# EAGLE design CanBus-Y (EAGLE 7.4.0)
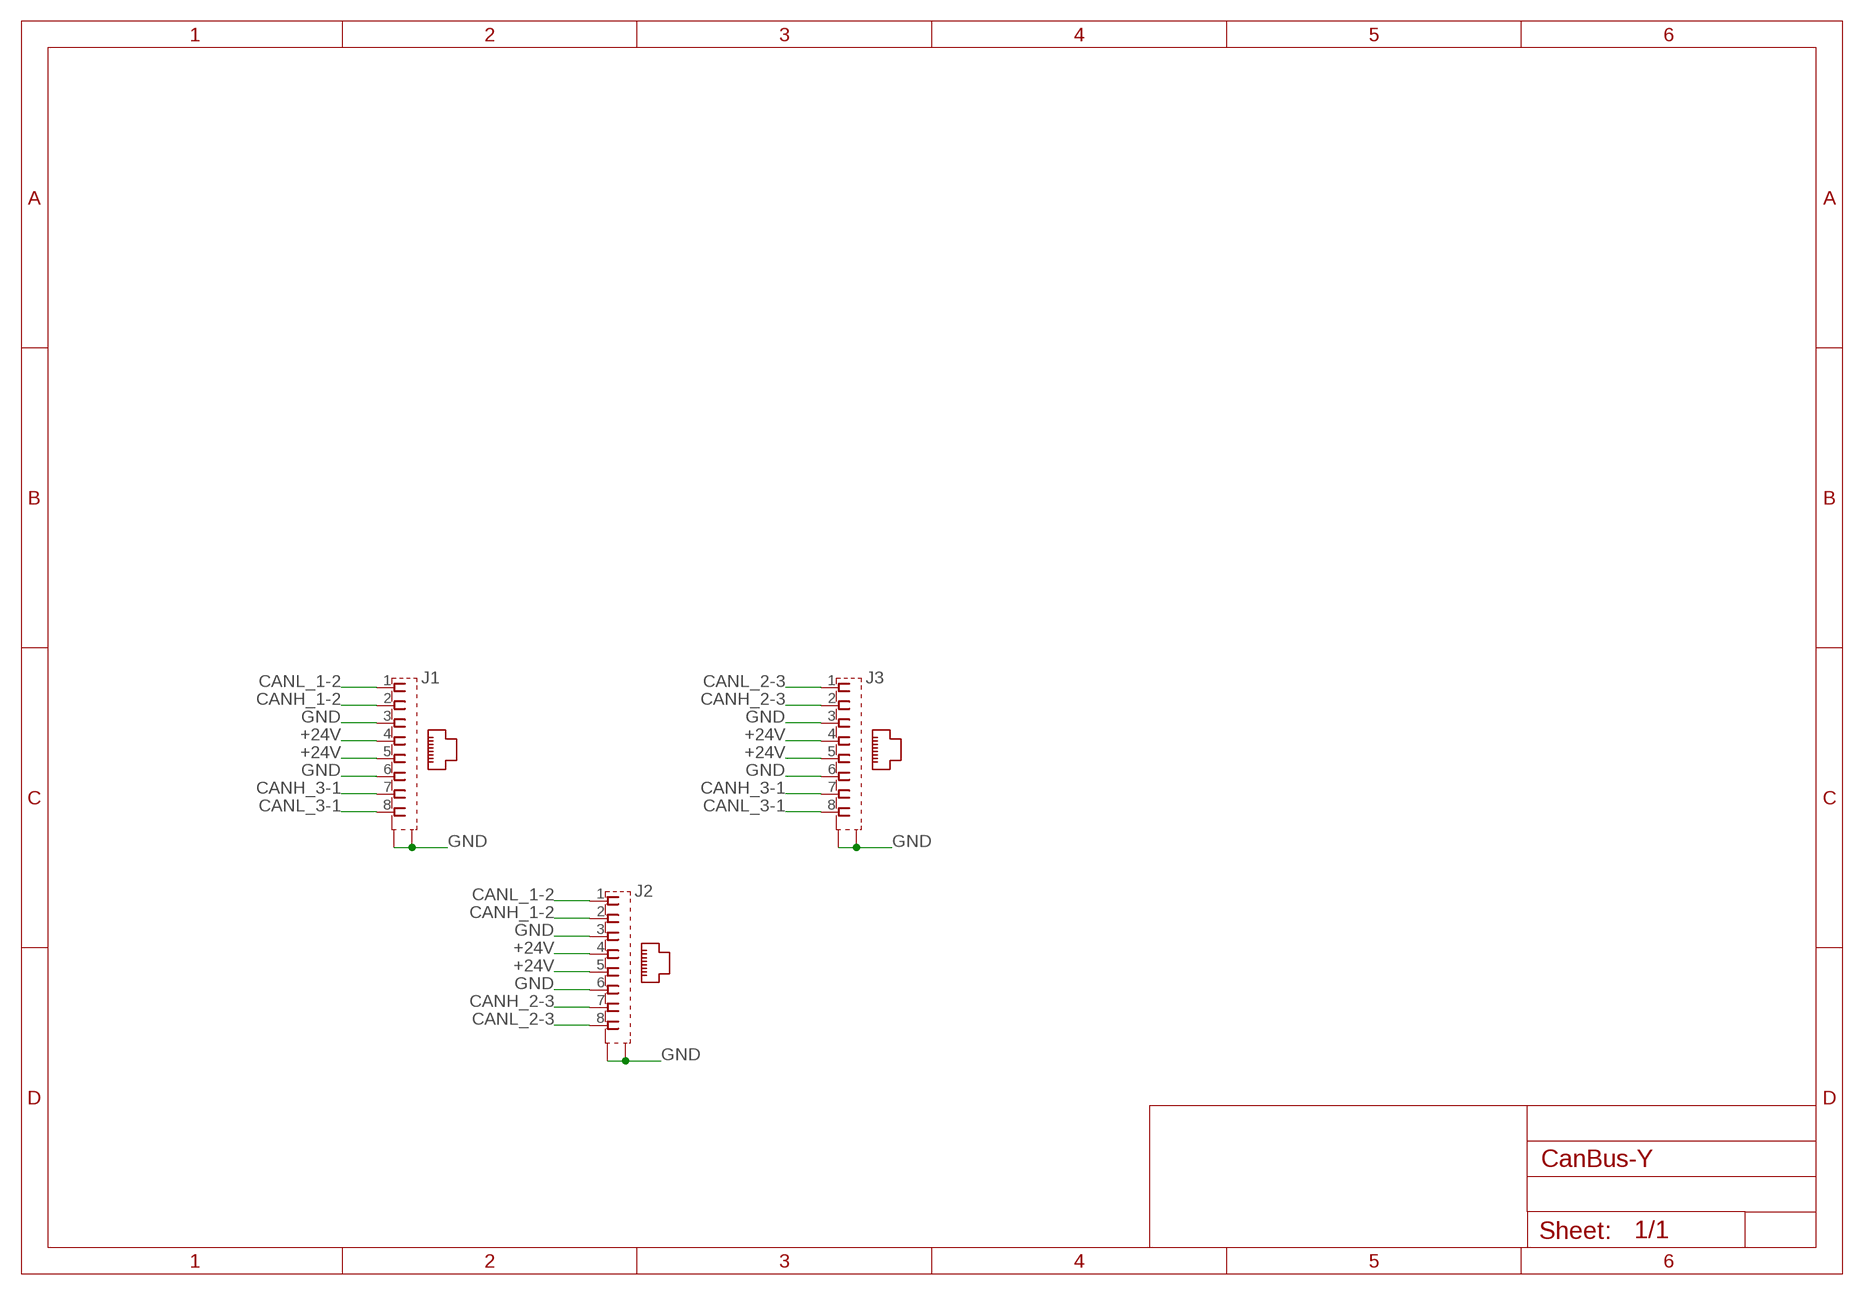
[diagram p0: schematic, sheet 1]

## Parts
J1  555141-1  [MEBP_8-8G]
J2  555141-1  [MEBP_8-8G]
J3  555141-1  [MEBP_8-8G]

## Nets
+24V: J1.4 J1.5 J2.4 J2.5 J3.4 J3.5
CANH_1-2: J1.2 J2.2
CANH_2-3: J2.7 J3.2
CANH_3-1: J1.7 J3.7
CANL_1-2: J1.1 J2.1
CANL_2-3: J2.8 J3.1
CANL_3-1: J1.8 J3.8
GND: J1.3 J1.6 J1.G1(S1) J1.G2(S2) J2.3 J2.6 J2.G1(S1) J2.G2(S2) J3.3 J3.6 J3.G1(S1) J3.G2(S2)

## Library data of the parts
J1-J3 = mebp_8-8g:555141-1: AMP connector Reichelt Bestell-Nr. MEBP 8-8G

## Board
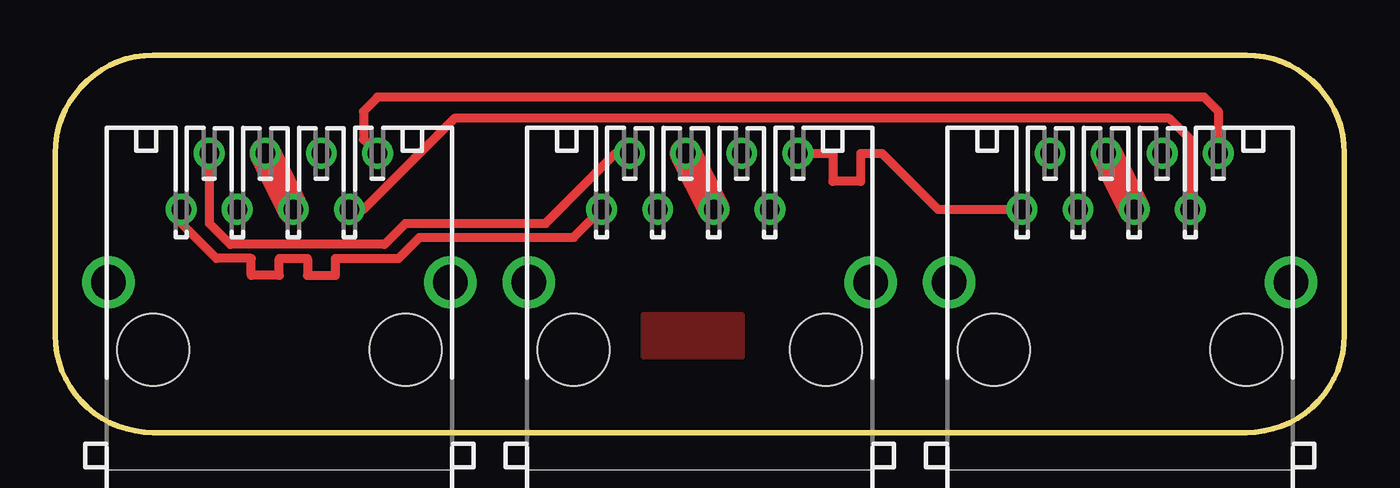
[diagram p1: board, top side]
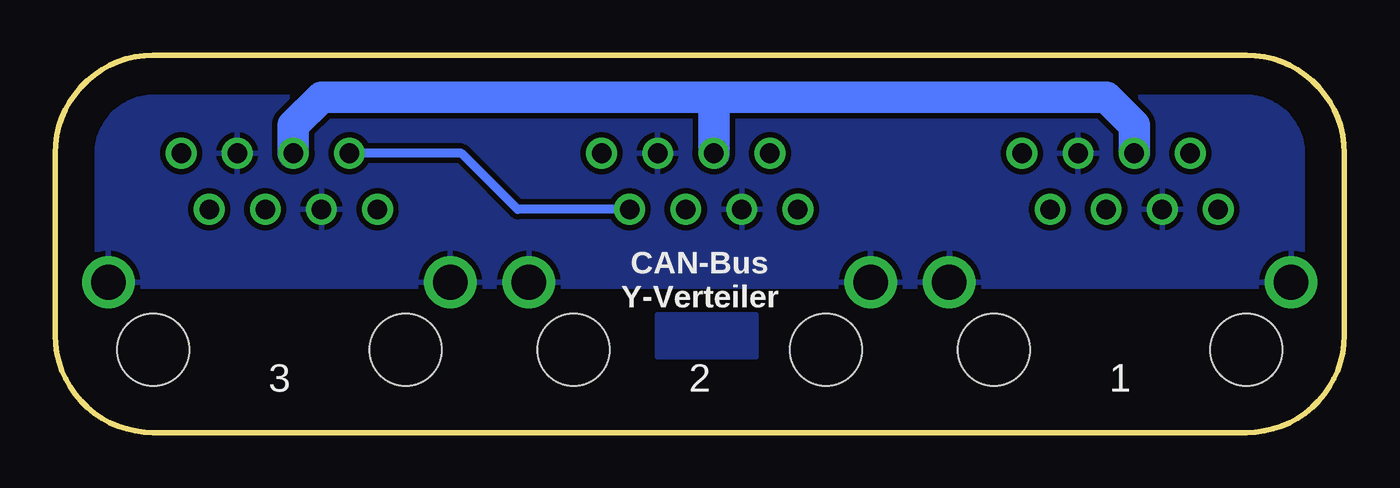
[diagram p2: board, bottom side, seen from below]

Size 58.42 x 17.09 mm. Coordinates in mm from the lower left corner, seen from the top.
Outline: 0,12.65 arc-90 4.45,17.09 53.98,17.09 arc-90 58.42,12.65 58.42,4.4 arc-90 53.98,0 4.45,0 arc-90 0,4.4 0,12.65
Copper layers (1*16): Top 0.035mm / dielectric 1.5mm / Bottom 0.035mm
Design rules "allpcb2": minimum track width 8mil, minimum drill 0.5mm, track to track 8mil, track to pad 8mil, pad to pad 8mil, via to via 8mil, smd to smd 6mil, copper to edge 40mil, drill to drill 8mil, minimum pad ring 10mil, minimum via ring 8mil, stop-mask expansion 0.1mm, vias tented up to drill 0mil, thermal gap 10mil

### Footprints (pad centres in the part's own frame; a part is rotated, then mirrored left to right if it is on the bottom)
MEBP_8-8G = drill 0.889: 1 -4.445,6.35; 2 -3.175,8.89; 3 -1.905,6.35; 4 -0.635,8.89; 5 0.635,6.35; 6 1.905,8.89; 7 3.175,6.35; 8 4.445,8.89 | drill 1.575 pad 2.184: G1 -7.745,3.05; G2 7.745,3.05 | hole 3.251: -5.715,0; 5.715,0

### Placement (x,y rotation side)
J1  10.16,3.76 0 top
J2  29.21,3.76 0 top
J3  48.26,3.76 0 top

### Tracks (layer width: path | path; a pad name or v marks a point on that pad's centre or on a via)
+24V
  Top 1.422: J1.4 J1.5 | J2.4 J2.5 | J3.4 J3.5
  Bottom 1.422: J2.4 28.58,15.19 | 28.58,15.19 10.79,15.19 9.53,13.92 J1.4 | 28.58,15.19 46.35,15.19 47.62,13.92 J3.4
BOT
  pour Bottom: 31.12,3.44 26.67,3.44 26.67,5.35 31.12,5.35
CANH_1-2
  Top 0.406: J1.2 6.98,9.48 7.94,8.52 14.92,8.52 15.88,9.48 22.23,9.48 25.4,12.65 J2.2
CANH_2-3
  Bottom 0.406: J2.7 37.46,10.11 40,12.65 J3.2
CANH_3-1
  Top 0.406: J3.7 51.43,13.29 50.48,14.24 18.1,14.24 13.97,10.11 J1.7
CANL_1-2
  Top 0.406: J1.1 5.71,9.48 7.3,7.89 8.89,7.89 8.89,7.12 10.16,7.12 10.16,7.88 11.43,7.88 11.43,7.12 12.7,7.12 12.7,7.89 15.56,7.89 16.51,8.84 23.5,8.84 J2.1
CANL_2-3
  Top 0.406: J3.1 40,10.11 37.46,12.65 36.51,12.65 36.51,11.38 35.24,11.38 35.24,12.65 J2.8
CANL_3-1
  Top 0.406: J3.8 52.7,14.56 52.07,15.19 14.61,15.19 13.97,14.56 13.97,13.29 J1.8
GND
  pour Bottom (isolate 0.254): 1.91,12.65 arc-90 4.45,15.19 53.98,15.19 arc-90 56.52,12.65 56.52,6.62 1.91,6.62
TOP
  pour Top: 31.12,3.44 26.67,3.44 26.67,5.35 31.12,5.35

### Text on the board
bNames: CAN-Bus / Y-Verteiler | 1 | 2 | 3
tRestrict: TOP
bRestrict: BOT